# EAGLE design FPV-Treff - Groundstation (EAGLE 7.6.0)
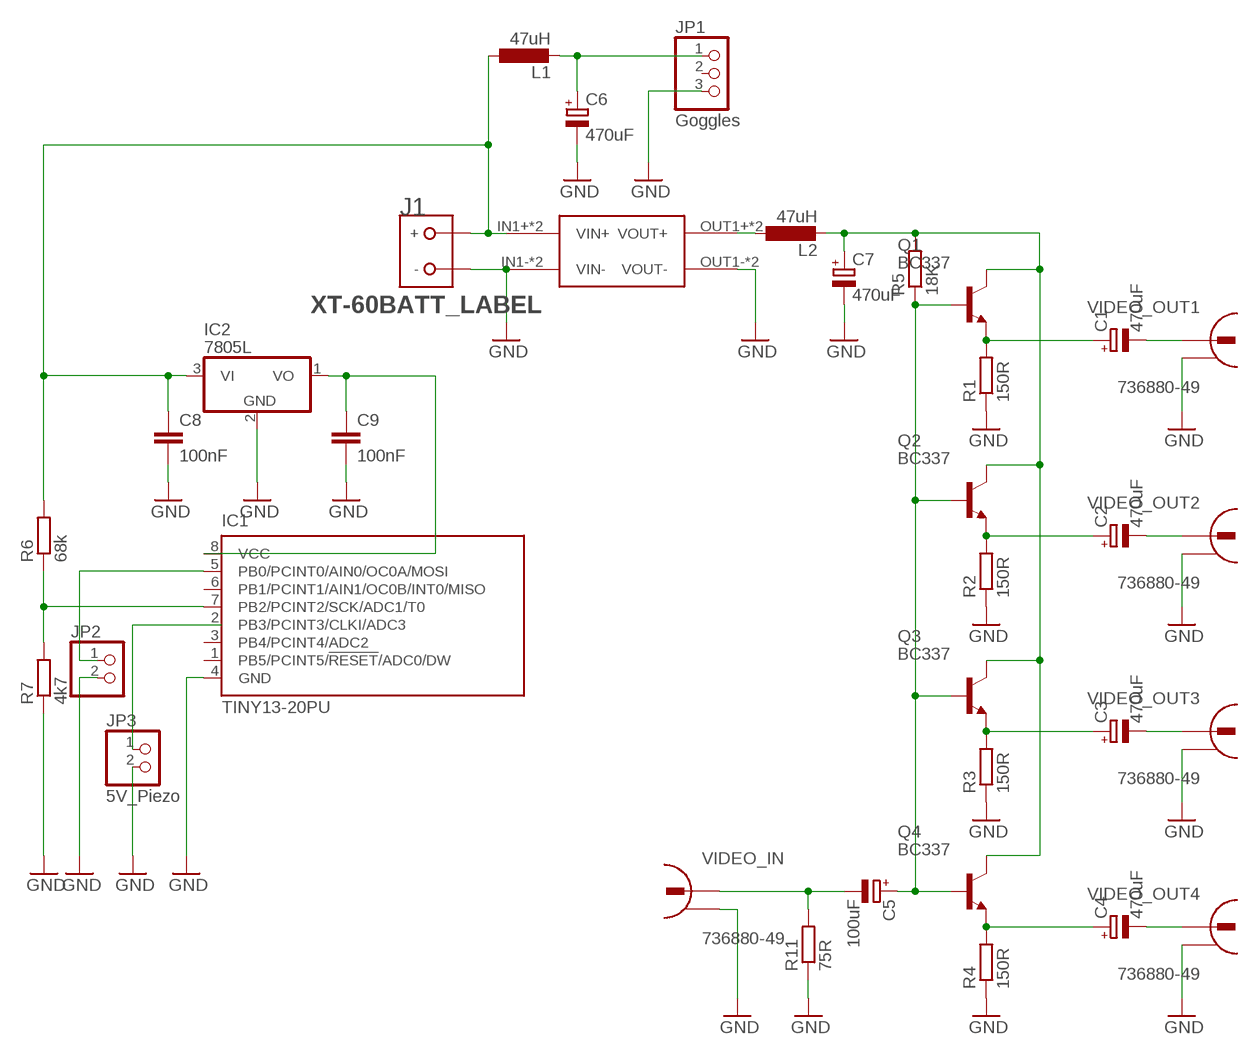
[diagram p0: schematic, sheet 1]

## Parts
C1  470uF  CPOL-EUB45181B  [B45181B]
C2  470uF  CPOL-EUB45181B  [B45181B]
C3  470uF  CPOL-EUB45181B  [B45181B]
C4  470uF  CPOL-EUB45181B  [B45181B]
C5  100uF  CPOL-EUB45181B  [B45181B]
C6  470uF  CPOL-EUB45181B  [B45181B]
C7  470uF  CPOL-EUB45181B  [B45181B]
C8  100nF  C-EU025_050-025X075  [C025_050-025X075]
C9  100nF  C-EU025_050-025X075  [C025_050-025X075]
IC1  TINY13-20PU  [DIL08]
IC2  7805L  [TO92]
J1  XT-60BATT_LABEL  [XT-60]
JP1  Goggles  PINHD-1X3  [1X03]
JP2  PINHD-1X2_2.54  [1X02]
JP3  5V_Piezo  PINHD-1X2_2.54  [1X02]
L1  47uH  L-EU0204V  [0204V]
L2  47uH  L-EU0204V  [0204V]
Q1  BC337  [TO92]
Q2  BC337  [TO92]
Q3  BC337  [TO92]
Q4  BC337  [TO92]
R1  150R  R-EU_0204/2V  [0204V]
R2  150R  R-EU_0204/2V  [0204V]
R3  150R  R-EU_0204/2V  [0204V]
R4  150R  R-EU_0204/2V  [0204V]
R5  18K  R-EU_0204/2V  [0204V]
R6  68k  R-EU_0207/10  [0207/10]
R7  4k7  R-EU_0207/10  [0207/10]
R11  75R  R-EU_0204/2V  [0204V]
U$1  MP1584  [DC-BRICK]
VIDEO_IN  736880-49  [736880-49]
VIDEO_OUT1  736880-49  [736880-49]
VIDEO_OUT2  736880-49  [736880-49]
VIDEO_OUT3  736880-49  [736880-49]
VIDEO_OUT4  736880-49  [736880-49]

## Nets
GND: C6.- C7.- C8.2 C9.2 IC1.4(GND) IC2.2(GND) J1.GND(-) JP1.3 JP2.2 JP3.2 R1.1 R2.1 R3.1 R4.1 R7.1 R11.1 U$1.IN1-(VIN-) U$1.IN2-(VIN-) U$1.OUT1-(VOUT-) U$1.OUT2-(VOUT-) VIDEO_IN.2 VIDEO_OUT1.2 VIDEO_OUT2.2 VIDEO_OUT3.2 VIDEO_OUT4.2
N$1: C2.+ Q2.1(E) R2.2
N$2: C6.+ JP1.1 L1.2
N$3: C2.- VIDEO_OUT2.1
N$4: C3.+ Q3.1(E) R3.2
N$5: C7.+ L2.2 Q1.3(C) Q2.3(C) Q3.3(C) Q4.3(C) R5.2
N$6: C3.- VIDEO_OUT3.1
N$7: C8.1 IC2.3(VI) J1.BATT(+) L1.1 R6.2 U$1.IN1+(VIN+) U$1.IN2+(VIN+)
N$8: C5.- R11.2 VIDEO_IN.1
N$9: L2.1 U$1.OUT1+(VOUT+) U$1.OUT2+(VOUT+)
N$10: IC1.5(PB0/PCINT0/AIN0/OC0A/MOSI) JP2.1
N$11: JP3.1
N$12: C9.1 IC1.8(VCC) IC2.1(VO)
N$14: IC1.7(PB2/PCINT2/SCK/ADC1/T0) R6.1 R7.2
N$54: C1.+ Q1.1(E) R1.2
N$55: C4.+ Q4.1(E) R4.2
N$56: C5.+ Q1.2(B) Q2.2(B) Q3.2(B) Q4.2(B) R5.1
N$70: C1.- VIDEO_OUT1.1
N$72: C4.- VIDEO_OUT4.1
Unconnected: IC1.1(PB5/PCINT5/!RESET!/ADC0/DW) IC1.2(PB3/PCINT3/CLKI/ADC3) IC1.3(PB4/PCINT4/ADC2) IC1.6(PB1/PCINT1/AIN1/OC0B/INT0/MISO) JP1.2 VIDEO_IN.2@2 VIDEO_OUT1.2@2 VIDEO_OUT2.2@2 VIDEO_OUT3.2@2 VIDEO_OUT4.2@2

## Library data of the parts
C1-C7 = resistor:CPOL-EU: POLARIZED CAPACITOR, European symbol
C8 C9 = rcl:C-EU: CAPACITOR, European symbol
IC1 = atmel(1):TINY13: 8-bit AVR Microcontroller with 1K Bytes In-System Programmable Flash Source: http://www.atmel.com/dyn/resources/prod_documents/2535S.pdf; MPN: ATTINY13-20PU; OC_FARNELL: 9171550; OC_NEWARK: 96K6521
IC2 = adafruit2:78*: Positive VOLTAGE REGULATOR Added bigger pads to the TO-92 package
J1 = RoboJackets-Connectors:XT-60: XT-60 Power Connector Distributor: HobbyKing <http://www.hobbyking.com/hobbyking/store/RC_PRODUCT_SEARCH.asp?strSearch=xt-60>
JP1 = pinhead:PINHD-1X3: PIN HEADER
JP2 JP3 = pinhead-1:PINHD-1X2: PIN HEADER
L1 L2 = resistor:L-EU: INDUCTOR, European symbol
Q1-Q4 = transistor-npn:BC337*: NPN Transistor
R1-R5 R11 = resistor:R-EU_: RESISTOR, European symbol
R6 R7 = rcl:R-EU_: RESISTOR, European symbol
U$1 = MP1584-dc-brick:MP1584: MP1584-dc-brick-pcb Step down Input: 4.5V - 28V Ouput 0.8V - 25V max. 3A Cheap on ebay
VIDEO_IN VIDEO_OUT1-VIDEO_OUT4 = con-conrad:736880-49: Cinch Connector ( RCA Jack )

## Board
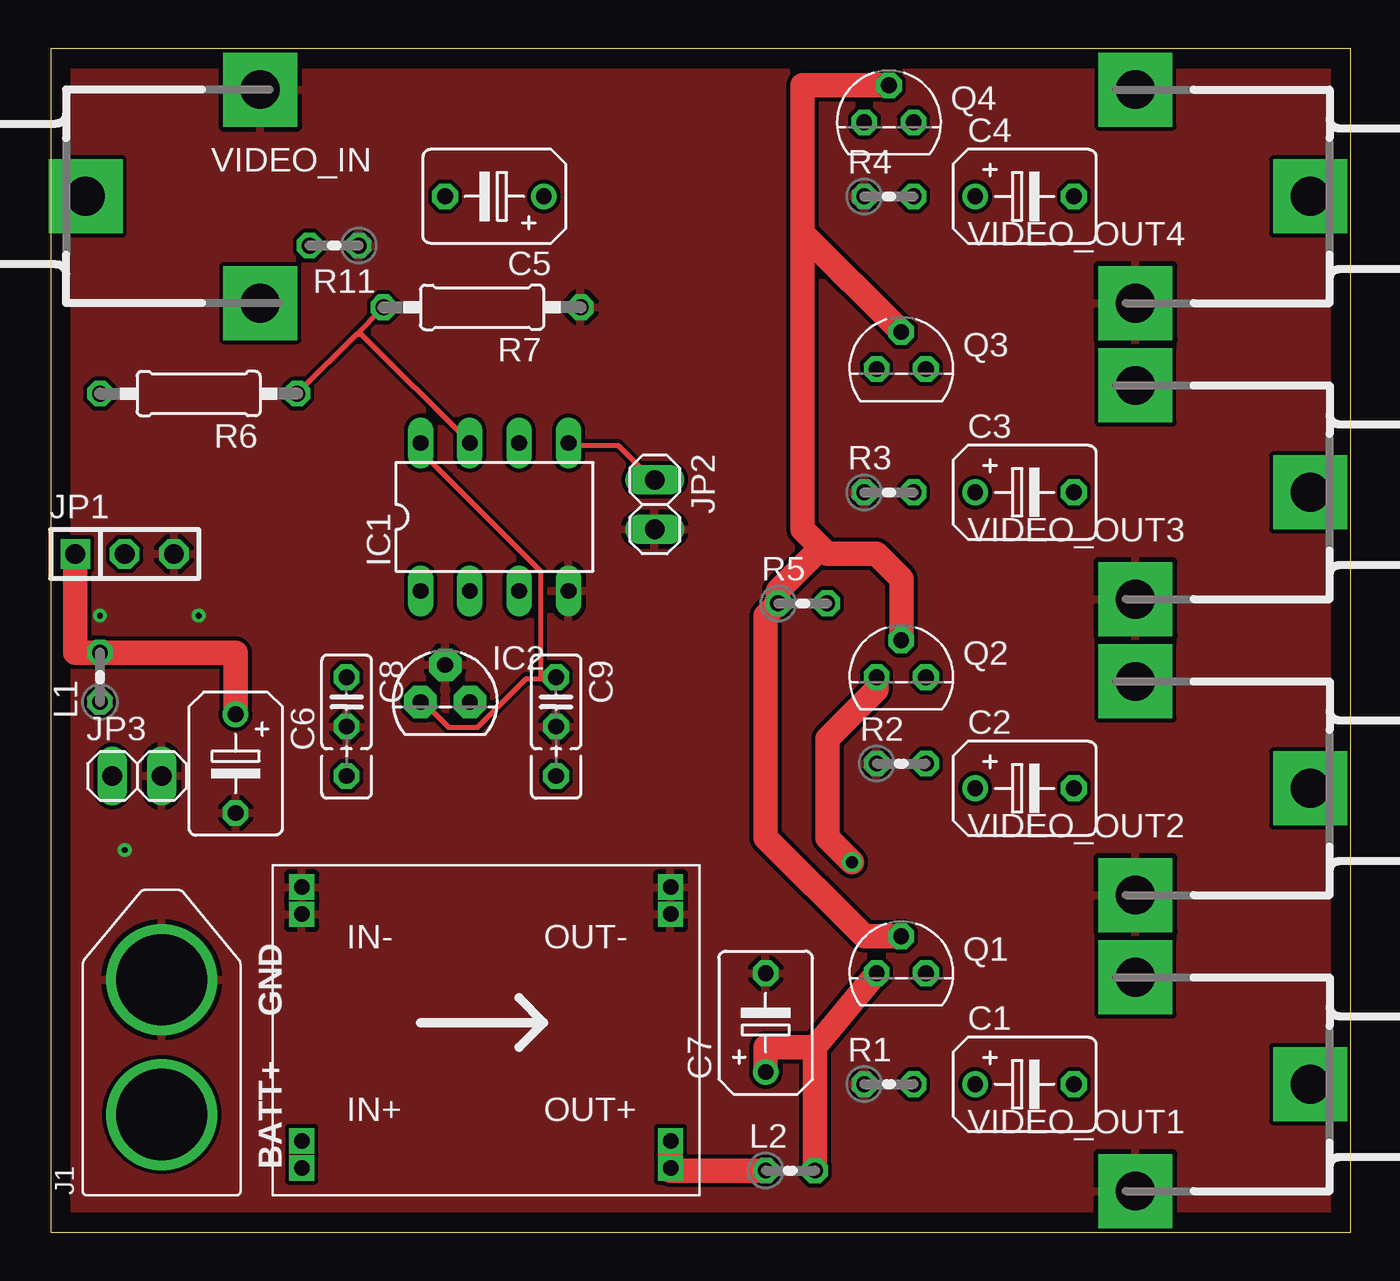
[diagram p1: board, top side]
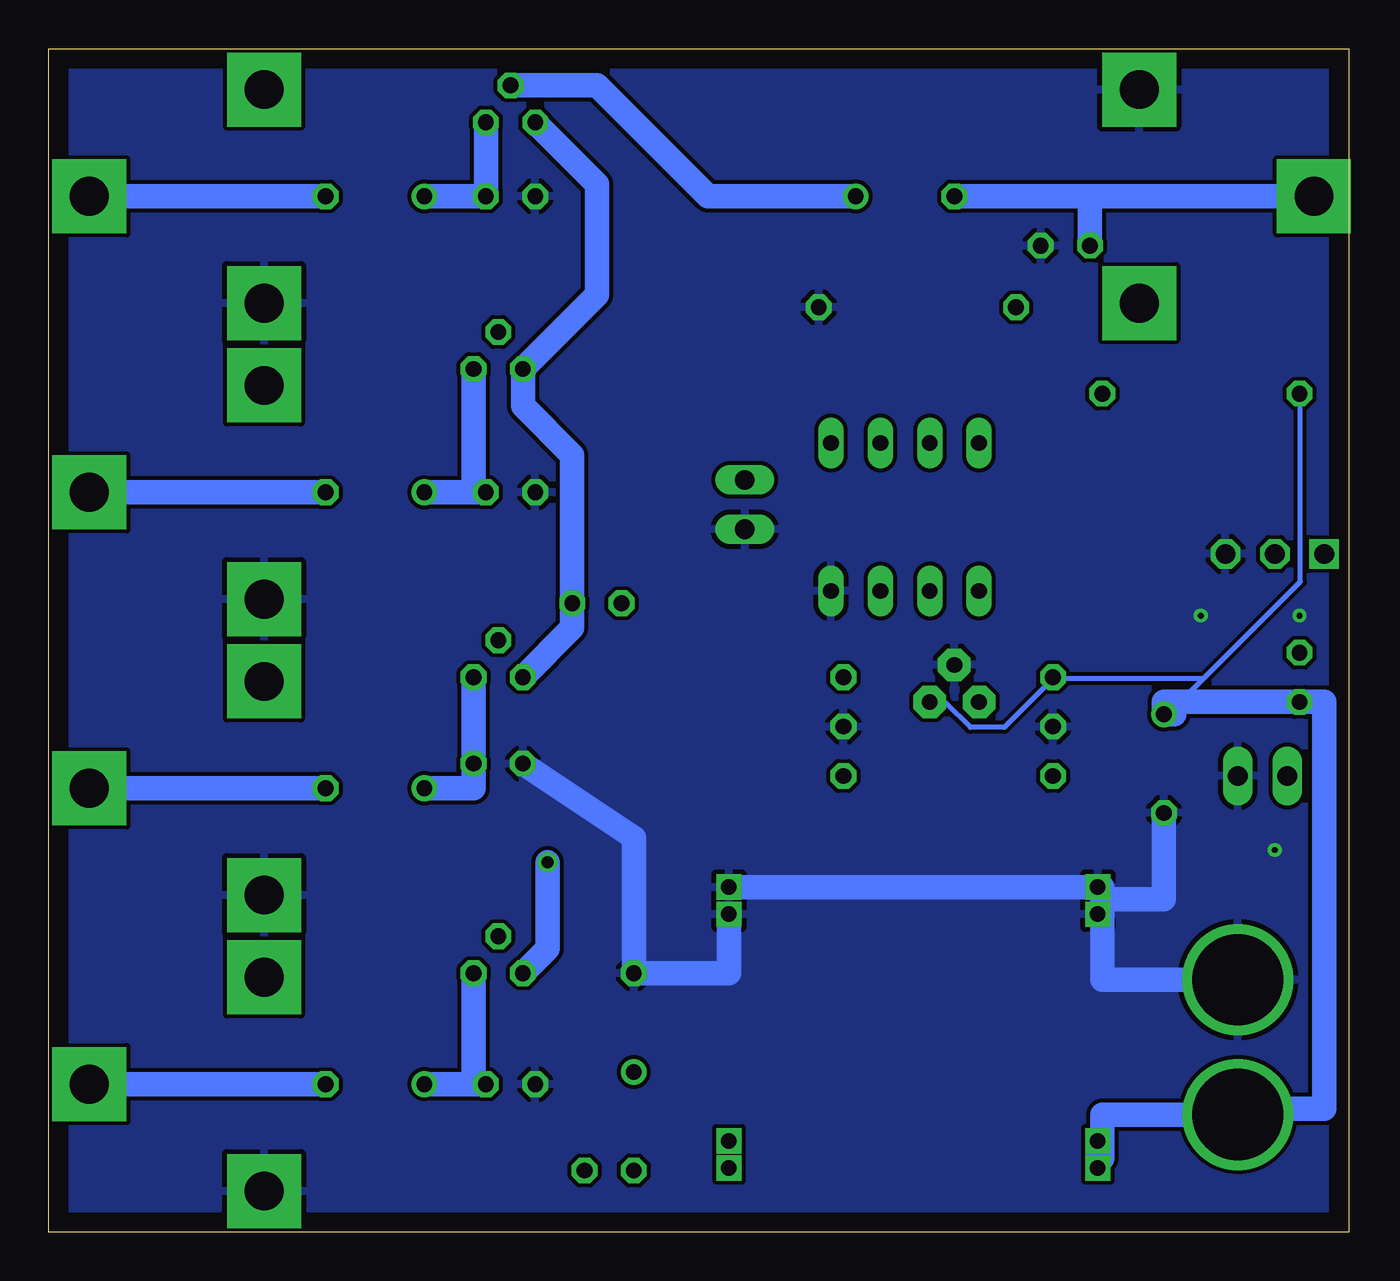
[diagram p2: board, bottom side, seen from below]

Size 66.98 x 60.95 mm. Coordinates in mm from the lower left corner, seen from the top.
Outline: 0,0 66.98,0 66.98,60.95 0,60.95 0,0
Copper layers (1*16): Top 0.035mm / dielectric 1.5mm / Bottom 0.035mm
Design rules "default": minimum track width 10mil, minimum drill 24mil, track to track 8mil, track to pad 8mil, pad to pad 8mil, via to via 8mil, smd to smd 8mil, copper to edge 40mil, drill to drill 8mil, minimum pad ring 10mil, minimum via ring 8mil, stop-mask expansion 4mil, vias tented up to drill 0mil, thermal gap 10mil

### Footprints (pad centres in the part's own frame; a part is rotated, then mirrored left to right if it is on the bottom)
B45181B = drill 0.813: + -2.54,0 | drill 0.813 octagon: - 2.54,0
C025_050-025X075 = drill 0.813 octagon: 1 -1.27,0; 2 1.27,0; 3 3.81,0
DIL08 = drill 0.813 long: 1 -3.81,-3.81; 2 -1.27,-3.81; 3 1.27,-3.81; 4 3.81,-3.81; 5 3.81,3.81; 6 1.27,3.81; 7 -1.27,3.81; 8 -3.81,3.81
TO92 = drill 0.813 pad 1.676 octagon: 1 -1.27,0; 2 0,1.905; 3 1.27,0
XT-60 = drill 4.7: BATT 0,4.154; GND 0,11.092
1X03 = drill 1.016 square: 1 -2.54,0 | drill 1.016 octagon: 2 0,0; 3 2.54,0
1X02 = drill 1.016 long: 1 -1.27,0; 2 1.27,0
0204V = drill 0.813 octagon: 1 -1.27,0; 2 1.27,0
TO92' = drill 0.813 octagon: 1 1.27,0; 2 0,1.905; 3 -1.27,0
0207/10 = drill 0.813 octagon: 1 -5.08,0; 2 5.08,0
DC-BRICK = drill 0.8 square: IN1+ 1.5,1.4; IN1- 1.5,14.47; IN2+ 1.5,2.8; IN2- 1.5,15.87; OUT1+ 20.5,1.4; OUT1- 20.5,14.47; OUT2+ 20.5,2.8; OUT2- 20.5,15.87
736880-49 = drill 2 pad 3.81 square: 1 -3.92,0; 2 5.08,5.5; 2@2 5.08,-5.5

### Placement (x,y rotation side)
C1  50.16,7.62 0 top
C2  50.16,22.86 0 top
C3  50.16,38.1 0 top
C4  50.16,53.34 0 top
C5  22.86,53.34 180 top
C6  9.53,24.13 270 top
C7  36.83,10.79 90 top
C8  15.24,27.3 270 top
C9  26.04,27.3 270 top
IC1  22.86,36.83 0 top
IC2  20.32,27.3 0 top
J1  5.71,1.91 0 top
JP1  3.81,34.92 0 top
JP2  31.11,37.47 270 top
JP3  4.45,23.5 0 top
L1  2.54,28.57 90 top
L2  38.1,3.17 0 top
Q1  BC337  [TO92']  43.81,13.34 0 top
Q2  BC337  [TO92']  43.81,28.57 0 top
Q3  BC337  [TO92']  43.81,44.45 0 top
Q4  BC337  [TO92']  43.18,57.15 0 top
R1  43.18,7.62 0 top
R2  43.81,24.13 0 top
R3  43.18,38.1 0 top
R4  43.18,53.34 0 top
R5  38.73,32.38 0 top
R6  7.62,43.18 180 top
R7  22.23,47.62 180 top
R11  14.61,50.8 180 top
U$1  11.43,1.91 0 top
VIDEO_IN  5.71,53.34 0 top
VIDEO_OUT1  60.96,7.62 180 top
VIDEO_OUT2  60.96,22.86 180 top
VIDEO_OUT3  60.96,38.1 180 top
VIDEO_OUT4  60.96,53.34 180 top

### Tracks (layer width: path | path; a pad name or v marks a point on that pad's centre or on a via)
GND  (via drill 0.3)
  Bottom 1.27: J1.GND 12.7,13 12.7,17.14 | 12.7,17.14 9.53,17.14 C6.- | U$1.OUT1- 31.93,13.34 C7.- 36.83,20.32 R2.1 | 12.7,17.14 12.7,17.77 U$1.OUT2-
  other vias: 2.54,31.75 7.62,31.75 3.81,19.68
  pour Top: 0,0 0,60.95 66.98,60.95 66.98,0
  pour Bottom: 0,0 0,60.95 66.98,60.95 66.98,0
N$1
  Bottom 1.27: C2.+ 45.09,22.86 R2.2 Q2.1
N$2
  Top 1.27: JP1.1 1.27,29.84 L1.2 9.53,29.84 C6.+
N$3
  Bottom 1.27: VIDEO_OUT2.1 C2.-
N$4
  Bottom 1.27: C3.+ 45.09,38.1 | 45.09,38.1 R3.2 | Q3.1 45.09,38.1
N$5  (via drill 0.6)
  Top 1.27: 39.37,9.53 Q1.3 | Q2.3 42.55,27.94 40.01,25.4 40.01,20.32 v41.27,19.05 | 39.37,9.53 36.83,9.53 C7.+ | L2.2 39.37,9.53
  Bottom 1.27: Q2.3 40.01,31.11 R5.2 40.01,40.01 42.55,42.55 Q3.3 38.73,48.26 38.73,53.98 Q4.3 | v41.27,19.05 41.27,14.61 Q1.3
N$6
  Bottom 1.27: VIDEO_OUT3.1 C3.-
N$7
  Bottom 0.254: 12.7,5 12.75,5 U$1.IN2+ | 9,27 7.5,28.5 | 7.5,28.5 2.5,33.5 2.5,43 R6.2 | 7.5,28.5 15,28.5 C8.1 15.25,28.5 17.75,26 19.5,26 20.75,27.25 21.5,27.25 IC2.3
  Bottom 1.27: 12.7,3.81 12.7,5 12.7,6.06 J1.BATT 5.71,6.35 1.27,6.35 1.27,27.3 L1.1 9.53,27.3 9.53,26.67 9,26.67 9,27 | U$1.IN1+ U$1.IN2+
N$8
  Bottom 1.27: C5.- 13.34,53.34 | 13.34,53.34 VIDEO_IN.1 | R11.2 13.34,53.34
N$9
  Top 1.27: L2.1 31.93,3.17 U$1.OUT1+ U$1.OUT2+
N$10
  Top 0.254: IC1.5 26.75,40.5 29.25,40.5 31,38.75 JP2.1
N$12
  Top 0.254: 25.25,28.5 24.5,28.5 22,26 20.5,26 19.25,27.25 IC2.1 | 25.25,28.5 26,28.5 C9.1 | 25.25,28.5 25.25,34 19.25,40 19.25,40.5 IC1.8
N$14
  Top 0.254: 15.75,46.25 17,47.5 R7.2 | 15.75,46.25 12.75,43.25 R6.1 | 15.75,46.25 16,46.25 21.5,40.75 IC1.7
N$54
  Bottom 1.27: C1.+ 45.09,7.62 | 45.09,7.62 R1.2 | Q1.1 45.09,7.62
N$55
  Bottom 1.27: C4.+ R4.2 Q4.1
N$56
  Top 1.27: Q4.2 38.73,59.05 38.73,51.44 | 38.73,51.44 Q3.2 | Q2.2 43.81,33.66 42.55,34.92 40.01,34.92 39.69,35.24 | 39.69,35.24 38.73,36.2 38.73,51.44 | Q1.2 41.91,15.24 36.83,20.32 36.83,31.75 R5.1 37.47,33.02 39.69,35.24
  Bottom 1.27: C5.+ 33.02,53.34 38.73,59.05 Q4.2
N$70
  Bottom 1.27: C1.- VIDEO_OUT1.1
N$72
  Bottom 1.27: VIDEO_OUT4.1 C4.-